# EAGLE design MainBoard_ver2_2 (EAGLE 9.6.2)
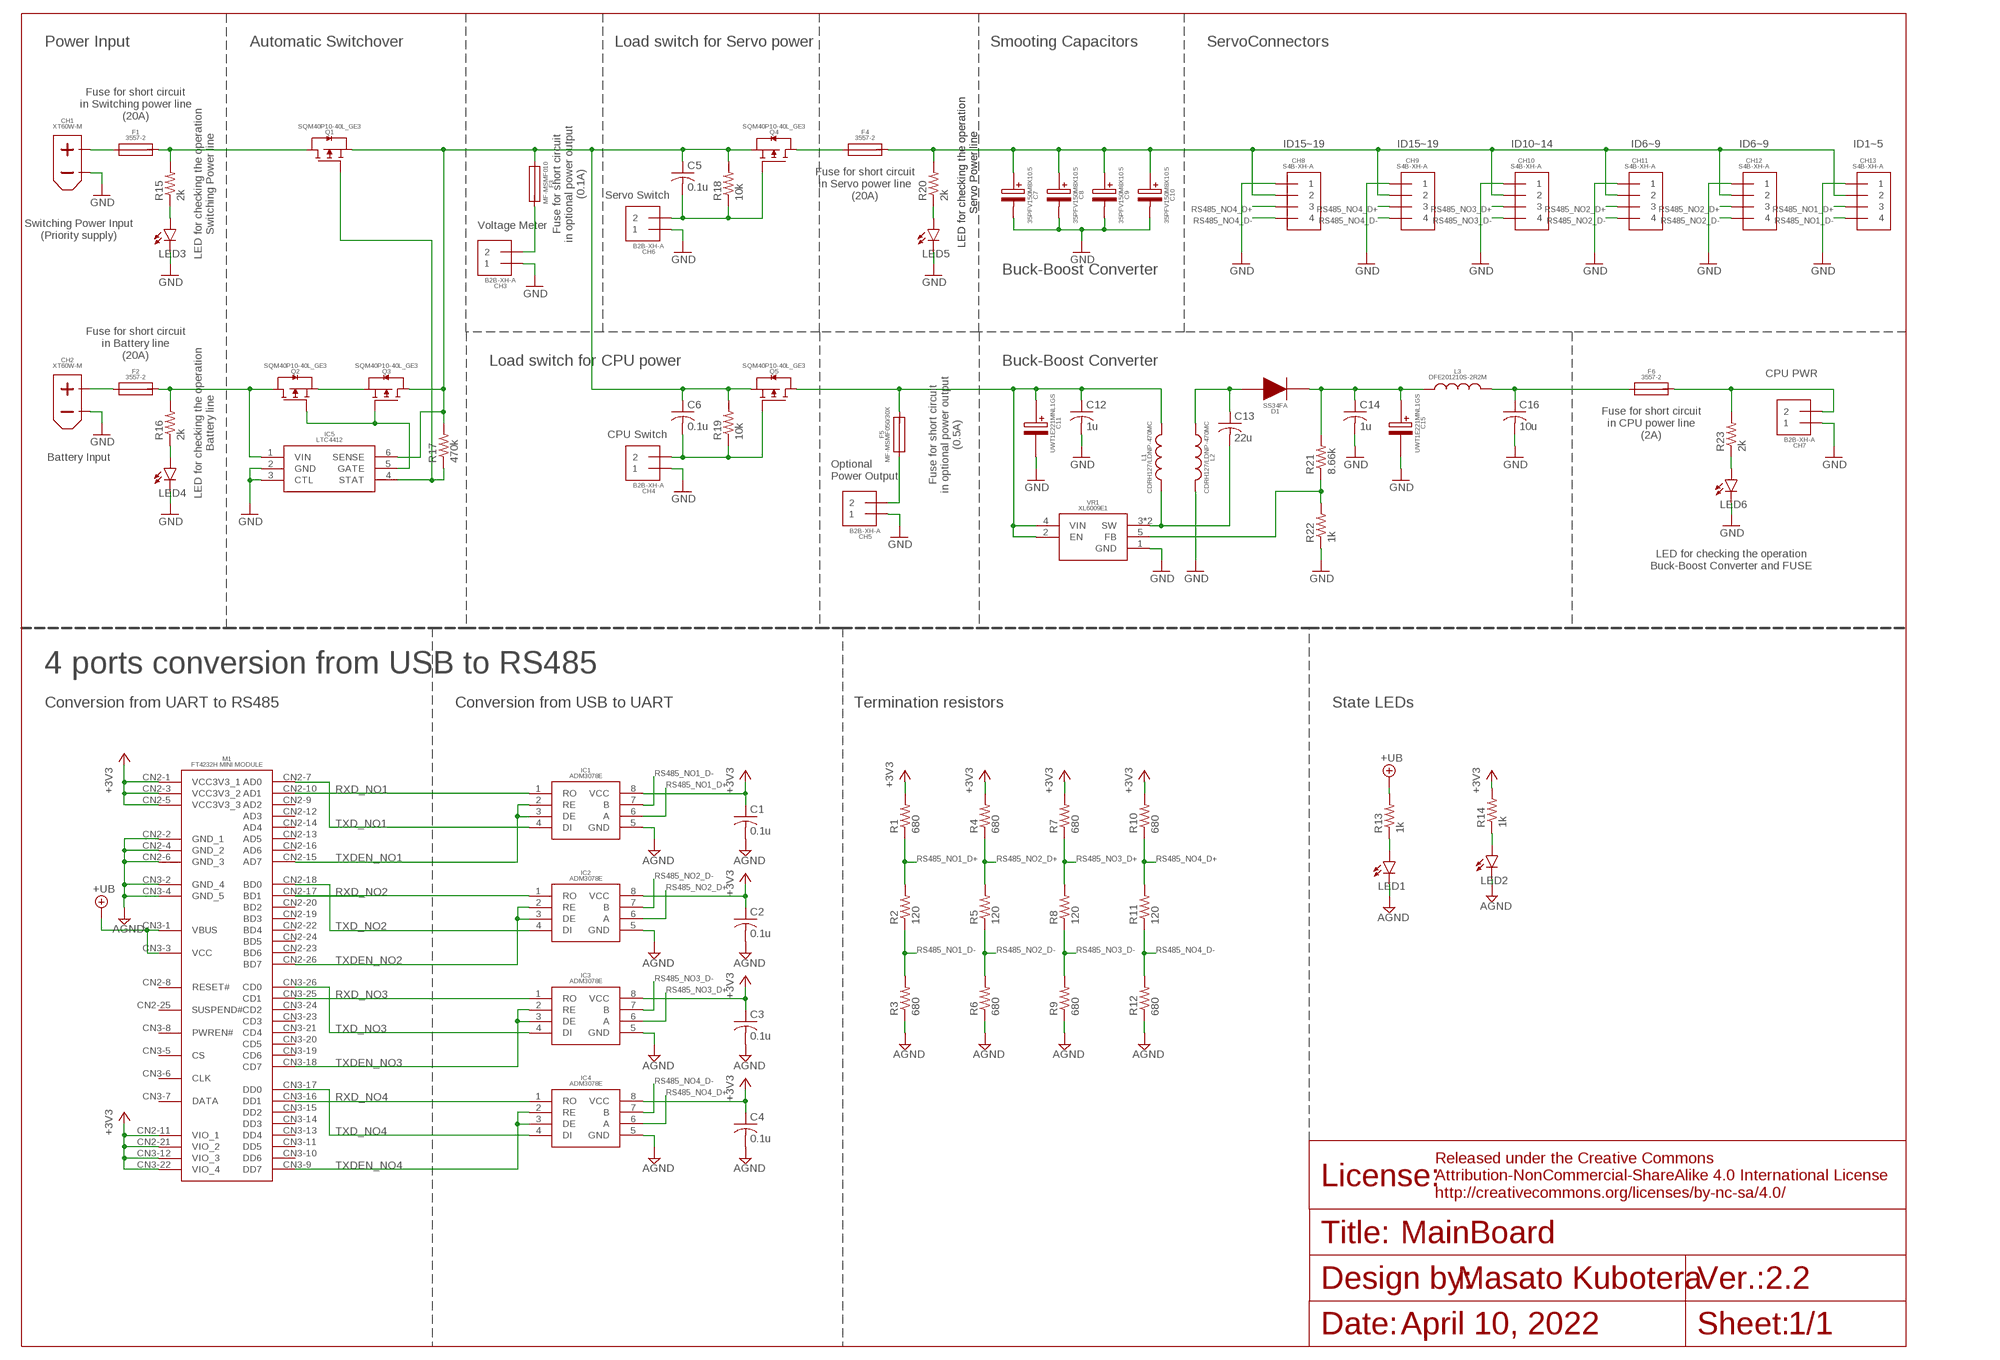
[diagram p0: schematic, sheet 1]

## Parts
C1  0.1u  C-USC0603  [C0603]
C2  0.1u  C-USC0603  [C0603]
C3  0.1u  C-USC0603  [C0603]
C4  0.1u  C-USC0603  [C0603]
C5  0.1u  C-USC0603  [C0603]
C6  0.1u  C-USC0603  [C0603]
C7  35PFV150M8X10.5  [35PFV150M8X10.5]
C8  35PFV150M8X10.5  [35PFV150M8X10.5]
C9  35PFV150M8X10.5  [35PFV150M8X10.5]
C10  35PFV150M8X10.5  [35PFV150M8X10.5]
C11  UWT1E221MNL1GS  [UWT1E221MNL1GS]
C12  1u  C-USC0603  [C0603]
C13  22u  C-USC2012  [C2012]
C14  1u  C-USC0603  [C0603]
C15  UWT1E221MNL1GS  [UWT1E221MNL1GS]
C16  10u  C-USC0603  [C0603]
CH1  XT60PW-M  [XT60PW-M]
CH2  XT60PW-M  [XT60PW-M]
CH3  B2B-XH-A  [B2B-XH-A]
CH4  B2B-XH-A  [B2B-XH-A]
CH5  B2B-XH-A  [B2B-XH-A]
CH6  B2B-XH-A  [B2B-XH-A]
CH7  B2B-XH-A  [B2B-XH-A]
CH8  S4B-XH-A  [S4B-XH-A]
CH9  S4B-XH-A  [S4B-XH-A]
CH10  S4B-XH-A  [S4B-XH-A]
CH11  S4B-XH-A  [S4B-XH-A]
CH12  S4B-XH-A  [S4B-XH-A]
CH13  S4B-XH-A  [S4B-XH-A]
D1  SS34FA  [SS34FA]
F1  3557-2  [3557-2]
F2  3557-2  [3557-2]
F3  MF-MSMF010  [MF-MSMF010]
F4  3557-2  [3557-2]
F5  MF-MSMF050/30X  [MF-MSMF050]
F6  3557-2  [3557-2]
IC1  ADM3078E  [ADM3078E]
IC2  ADM3078E  [ADM3078E]
IC3  ADM3078E  [ADM3078E]
IC4  ADM3078E  [ADM3078E]
IC5  LTC4412  [LTC4412]
L1  CDRH127/LDNP-470MC  [CDRH127/LDNP]
L2  CDRH127/LDNP-470MC  [CDRH127/LDNP]
L3  DFE201210S-2R2M  [DFE201210S]
LED1  LEDSML0603  [SML0603]
LED2  LEDSML0603  [SML0603]
LED3  LEDSML0603  [SML0603]
LED4  LEDSML0603  [SML0603]
LED5  LEDSML0603  [SML0603]
LED6  LEDSML0603  [SML0603]
M1  FT4232H_MINI_MODULE  [FT4232H_MINI_MODULE]
Q1  SQM40P10-40L_GE3  [TO-252-3]
Q2  SQM40P10-40L_GE3  [TO-252-3]
Q3  SQM40P10-40L_GE3  [TO-252-3]
Q4  SQM40P10-40L_GE3  [TO-252-3]
Q5  SQM40P10-40L_GE3  [TO-252-3]
R1  680  R-US_R0603  [R0603]
R2  120  R-US_R0603  [R0603]
R3  680  R-US_R0603  [R0603]
R4  680  R-US_R0603  [R0603]
R5  120  R-US_R0603  [R0603]
R6  680  R-US_R0603  [R0603]
R7  680  R-US_R0603  [R0603]
R8  120  R-US_R0603  [R0603]
R9  680  R-US_R0603  [R0603]
R10  680  R-US_R0603  [R0603]
R11  120  R-US_R0603  [R0603]
R12  680  R-US_R0603  [R0603]
R13  1k  R-US_R0603  [R0603]
R14  1k  R-US_R0603  [R0603]
R15  2k  R-US_R0603  [R0603]
R16  2k  R-US_R0603  [R0603]
R17  470k  R-US_R0603  [R0603]
R18  10k  R-US_R0603  [R0603]
R19  10k  R-US_R0603  [R0603]
R20  2k  R-US_R0603  [R0603]
R21  8.66k  R-US_R0603  [R0603]
R22  1k  R-US_R0603  [R0603]
R23  2k  R-US_R0603  [R0603]
VR1  XL6009E1  [TO263-5L]

## Nets
+3V3 [USB-Power]: C1.1 C2.1 C3.1 C4.1 IC1.8(VCC) IC2.8(VCC) IC3.8(VCC) IC4.8(VCC) M1.CN2-1(VCC3V3_1) M1.CN2-3(VCC3V3_2) M1.CN2-5(VCC3V3_3) M1.CN2-11(VIO_1) M1.CN2-21(VIO_2) M1.CN3-12(VIO_3) M1.CN3-22(VIO_4) R1.2 R4.2 R7.2 R10.2 R14.2
+UB [USB-Power]: M1.CN3-1(VBUS) M1.CN3-3(VCC) R13.2
A_DIODE_DCDC [DCDC-Power]: C14.1 C15.+ D1.1 L3.1 R21.2
A_FUSE_BATT [Battery-Power]: F2.3 F2.4 IC5.1(VIN) Q2.4(D) R16.2
A_FUSE_DCDC [DCDC-Power]: CH7.2 F6.3 F6.4 R23.2
A_FUSE_METER [Meter]: CH3.2 F3.2
A_FUSE_PWR [Battery-Power]: F1.3 F1.4 Q1.4(D) R15.2
A_FUSE_SERVO [Battery-Power]: C7.+ C8.+ C9.+ C10.+ CH8.2 CH9.2 CH10.2 CH11.2 CH12.2 CH13.2 F4.3 F4.4 R20.2
AGND [USB-Power]: C1.2 C2.2 C3.2 C4.2 IC1.5(GND) IC2.5(GND) IC3.5(GND) IC4.5(GND) LED1.C LED2.C M1.CN2-2(GND_1) M1.CN2-4(GND_2) M1.CN2-6(GND_3) M1.CN3-2(GND_4) M1.CN3-4(GND_5) R3.1 R6.1 R9.1 R12.1
B_DIODE_DCDC [DCDC-Power]: C13.1 D1.2 L2.1
B_FUSE_BATT [FUSE-Power]: CH2.+ F2.1 F2.2
B_FUSE_DCDC [DCDC-Power]: C16.1 F6.1 F6.2 L3.2
B_FUSE_PWR [FUSE-Power]: CH1.+ F1.1 F1.2
B_FUSE_SERVO [Battery-Power]: F4.1 F4.2 Q4.4(D)
B_LOAD_CPU [Power_Switching]: C6.2 CH4.2 Q5.1(G) R19.1
B_LOAD_SERVO [Power_Switching]: C5.2 CH6.2 Q4.1(G) R18.1
CPU_PWR_IN [CPU-Power]: C11.+ C12.1 F5.2 L1.2 Q5.4(D) VR1.2(EN) VR1.4(VIN)
FB_DCDC [DCDC-Power]: R21.1 R22.2 VR1.5(FB)
GND [Battery-Power]: C7.- C8.- C9.- C10.- C11.- C12.2 C14.2 C15.- C16.2 CH1.- CH2.- CH3.1 CH4.1 CH5.1 CH6.1 CH7.1 CH8.1 CH9.1 CH10.1 CH11.1 CH12.1 CH13.1 IC5.2(GND) IC5.3(CTL) L2.2 LED3.C LED4.C LED5.C LED6.C R22.1 VR1.1(GND)
INPUT_PWR [Battery-Power]: C5.1 C6.1 F3.1 IC5.6(SENSE) Q1.3(S) Q3.4(D) Q4.3(S) Q5.3(S) R17.2 R18.2 R19.2
LED_3V3 [LED]: LED2.A R14.1
LED_BATT [LED]: LED4.A R16.1
LED_DCDCOUT [LED]: LED6.A R23.1
LED_PWR [LED]: LED3.A R15.1
LED_SERVO [LED]: LED5.A R20.1
LED_UB [LED]: LED1.A R13.1
LTC4412_GATE [Power_Switching]: IC5.5(GATE) Q2.1(G) Q3.1(G)
LTC4412_STAT [Power_Switching]: IC5.4(STAT) Q1.1(G) R17.1
POWER_OUTPUT [PowerOutput]: CH5.2 F5.1
RS485_NO1_D+ [USB-Data]: CH13.3 IC1.6(A) R1.1 R2.2
RS485_NO1_D- [USB-Data]: CH13.4 IC1.7(B) R2.1 R3.2
RS485_NO2_D+ [USB-Data]: CH11.3 CH12.3 IC2.6(A) R4.1 R5.2
RS485_NO2_D- [USB-Data]: CH11.4 CH12.4 IC2.7(B) R5.1 R6.2
RS485_NO3_D+ [USB-Data]: CH10.3 IC3.6(A) R7.1 R8.2
RS485_NO3_D- [USB-Data]: CH10.4 IC3.7(B) R8.1 R9.2
RS485_NO4_D+ [USB-Data]: CH8.3 CH9.3 IC4.6(A) R10.1 R11.2
RS485_NO4_D- [USB-Data]: CH8.4 CH9.4 IC4.7(B) R11.1 R12.2
RXD_NO1 [USB-Data]: IC1.1(RO) M1.CN2-10(AD1)
RXD_NO2 [USB-Data]: IC2.1(RO) M1.CN2-17(BD1)
RXD_NO3 [USB-Data]: IC3.1(RO) M1.CN3-25(CD1)
RXD_NO4 [USB-Data]: IC4.1(RO) M1.CN3-16(DD1)
SOURCE [Battery-Power]: Q2.3(S) Q3.3(S)
SW_DCDC [DCDC-Power]: C13.2 L1.1 VR1.3(SW) VR1.6(SW)
TXD_NO1 [USB-Data]: IC1.4(DI) M1.CN2-7(AD0)
TXD_NO2 [USB-Data]: IC2.4(DI) M1.CN2-18(BD0)
TXD_NO3 [USB-Data]: IC3.4(DI) M1.CN3-26(CD0)
TXD_NO4 [USB-Data]: IC4.4(DI) M1.CN3-17(DD0)
TXDEN_NO1 [USB-Data]: IC1.2(RE) IC1.3(DE) M1.CN2-15(AD7)
TXDEN_NO2 [USB-Data]: IC2.2(RE) IC2.3(DE) M1.CN2-26(BD7)
TXDEN_NO3 [USB-Data]: IC3.2(RE) IC3.3(DE) M1.CN3-18(CD7)
TXDEN_NO4 [USB-Data]: IC4.2(RE) IC4.3(DE) M1.CN3-9(DD7)
Unconnected: M1.CN2-8(RESET#) M1.CN2-9(AD2) M1.CN2-12(AD3) M1.CN2-13(AD5) M1.CN2-14(AD4) M1.CN2-16(AD6) M1.CN2-19(BD3) M1.CN2-20(BD2) M1.CN2-22(BD4) M1.CN2-23(BD6) M1.CN2-24(BD5) M1.CN2-25(SUSPEND#) M1.CN3-5(CS) M1.CN3-6(CLK) M1.CN3-7(DATA) M1.CN3-8(PWREN#) M1.CN3-10(DD6) M1.CN3-11(DD5) M1.CN3-13(DD4) M1.CN3-14(DD3) M1.CN3-15(DD2) M1.CN3-19(CD6) M1.CN3-20(CD5) M1.CN3-21(CD4) M1.CN3-23(CD3) M1.CN3-24(CD2)

## Notes on the sheet
- Power Input | Automatic Switchover | Load switch for Servo power | Smooting Capacitors | ServoConnectors
- Fuse for short circuit
  in Switching power line
  (20A)
- ID15~19 | ID15~19 | ID10~14 | ID6~9 | ID6~9 | ID1~5
- LED for checking the operation
  Servo Power line
- LED for checking the operation
  Servo Power line
- LED for checking the operation
  Switching Power line
- Fuse for short circuit
  in optional power output
  (0.1A)
- Fuse for short circuit
  in Servo power line
  (20A)
- Servo Switch
- Switching Power Input
  (Priority supply)
- Voltage Meter
- Buck-Boost Converter
- Fuse for short circuit
  in Battery line
  (20A)
- Load switch for CPU power | Buck-Boost Converter
- CPU PWR
- LED for checking the operation
  Battery line
- Fuse for short circuit
  in CPU power line
  (2A)
- CPU Switch
- Fuse for short circuit
  in optional power output
  (0.5A)
- Battery Input
- Optional
  Power Output
- LED for checking the operation
  Buck-Boost Converter and FUSE
- 4 ports conversion from USB to RS485
- Conversion from UART to RS485 | Conversion from USB to UART | Termination resistors | State LEDs
- MainBoard
- 2.2
- April 10, 2022 | 1/1

## Library data of the parts
C1-C6 C12-C14 C16 = rcl:C-US: CAPACITOR, American symbol; SPICEPREFIX: C
C7-C10 = 35PFV150M8X10.5:35PFV150M8X10.5
C11 C15 = UWT1E221MNL1GS:UWT1E221MNL1GS
CH1 CH2 = AMASS_XT60:XT60PW-M
CH3-CH7 = JST-XH:B2B-XH-A
CH8-CH13 = JST-XH:S4B-XH-A
D1 = SS34FA:SS34FA
F1 F2 F4 F6 = 3557-2:3557-2
F3 = MF-MSMF:MF-MSMF010
F5 = MF-MSMF:MF-MSMF050/30X
IC1-IC4 = ADM3078E:ADM3078E
IC5 = LTC4412:LTC4412
L1 L2 = CDRH127_LDNP:CDRH127/LDNP-470MC
L3 = DFE201210S:DFE201210S-2R2M
LED1-LED6 = led:LED: LED OSRAM: - CHIPLED LG R971, LG N971, LY N971, LG Q971, LY Q971, LO R971, LY R971 LH N974, LH R974 LS Q976, LO Q976, LY Q976 LO Q996 - Hyper CHIPLED LW Q18S LB Q993, LB Q99A, LB R99A - SideLED LS A670, LO A670, LY A670, LG A670, LP A670 LB A673, LV A673, LT A673, LW A673 LH A674 LY A675 LS A676, LA A676, LO A676, LY A676, LW A676 LS A679, LY A679, LG A679 - Hyper Micro SIDELED® LS Y876, LA Y876, LO Y876, LY Y876 LT Y87S - SmartLED LW L88C, LW L88S LB L89C, LB L89S, LG L890 LS L89K, LO L89K, LY L89K LS L896, LA L896, LO L896, LY L896 - TOPLED LS T670, LO T670, LY T670, LG T670, LP T670 LSG T670, LSP T670, LSY T670, LOP T670, LYG T670 LG T671, LOG T671, LSG T671 LB T673, LV T673, LT T673, LW T673 LH T674 LS T676, LA T676, LO T676, LY T676, LB T676, LH T676, LSB T676, LW T676 LB T67C, LV T67C, LT T67C, LS T67K, LO T67K, LY T67K, LW E67C LS E67B, LA E67B, LO E67B, LY E67B, LB E67C, LV E67C, LT E67C LW T67C LS T679, LY T679, LG T679 LS T770, LO T770, LY T770, LG T770, LP T770 LB T773, LV T773, LT T773, LW T773 LH T774 LS E675, LA E675, LY E675, LS T675 LS T776, LA T776, LO T776, LY T776, LB T776 LHGB T686 LT T68C, LB T68C - Hyper Mini TOPLED® LB M676 - Mini TOPLED Santana® LG M470 LS M47K, LO M47K, LY M47K Source: http://www.osram.convergy.de LUXEON: - LUMILED® LXK2-PW12-R00, LXK2-PW12-S00, LXK2-PW14-U00, LXK2-PW14-V00 LXK2-PM12-R00, LXK2-PM12-S00, LXK2-PM14-U00 LXK2-PE12-Q00, LXK2-PE12-R00, LXK2-PE12-S00, LXK2-PE14-T00, LXK2-PE14-U00 LXK2-PB12-K00, LXK2-PB12-L00, LXK2-PB12-M00, LXK2-PB14-N00, LXK2-PB14-P00, LXK2-PB14-Q00 LXK2-PR12-L00, LXK2-PR12-M00, LXK2-PR14-Q00, LXK2-PR14-R00 LXK2-PD12-Q00, LXK2-PD12-R00, LXK2-PD12-S00 LXK2-PH12-R00, LXK2-PH12-S00 LXK2-PL12-P00, LXK2-PL12-Q00, LXK2-PL12-R00 Source: www.luxeon.com KINGBRIGHT: KA-3528ASYC Source: www.kingbright.com
M1 = FT4232H_MINI_MODULE:FT4232H_MINI_MODULE
Q1-Q5 = Vishay_FET:SQM40P10-40L_GE3
R1-R23 = rcl:R-US_: RESISTOR, American symbol; SPICEPREFIX: R
VR1 = XL6009E1:XL6009E1

## Net classes
0 default: width 0.254 mm, drill 0.127 mm, clearance 0.203 mm
1 USB-Data: width 0.203 mm, drill 0.127 mm, clearance 0.203 mm
2 USB-Power: width 0.254 mm, drill 0.127 mm, clearance 0.203 mm
3 CPU-Power: width 2.54 mm, drill 1.27 mm, clearance 0.203 mm
4 Battery-Power: width 2.54 mm, drill 1.27 mm, clearance 0.203 mm
5 FUSE-Power: width 3.048 mm, drill 1.27 mm, clearance 0.203 mm
6 DCDC-Power: width 1.143 mm, drill 0.254 mm, clearance 0.203 mm
7 Power_Switching: width 0.508 mm, drill 0.254 mm, clearance 0.203 mm
8 LED: width 0.254 mm, drill 0.127 mm, clearance 0.203 mm
9 Meter: width 0.508 mm, drill 0.254 mm, clearance 0.203 mm
10 PowerOutput: width 1.143 mm, drill 0.254 mm, clearance 0.203 mm

## Board
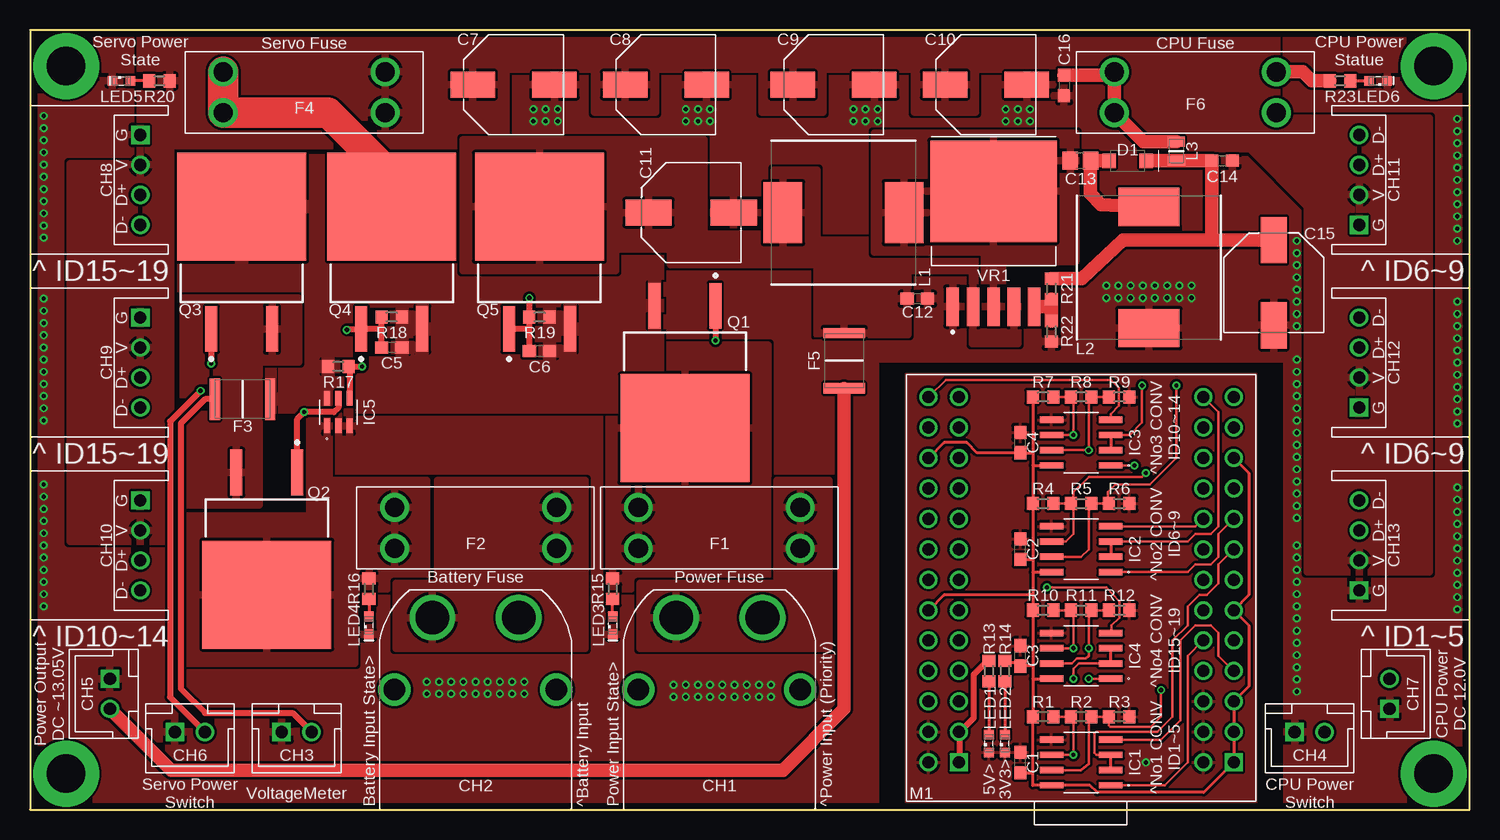
[diagram p1: board, top side]
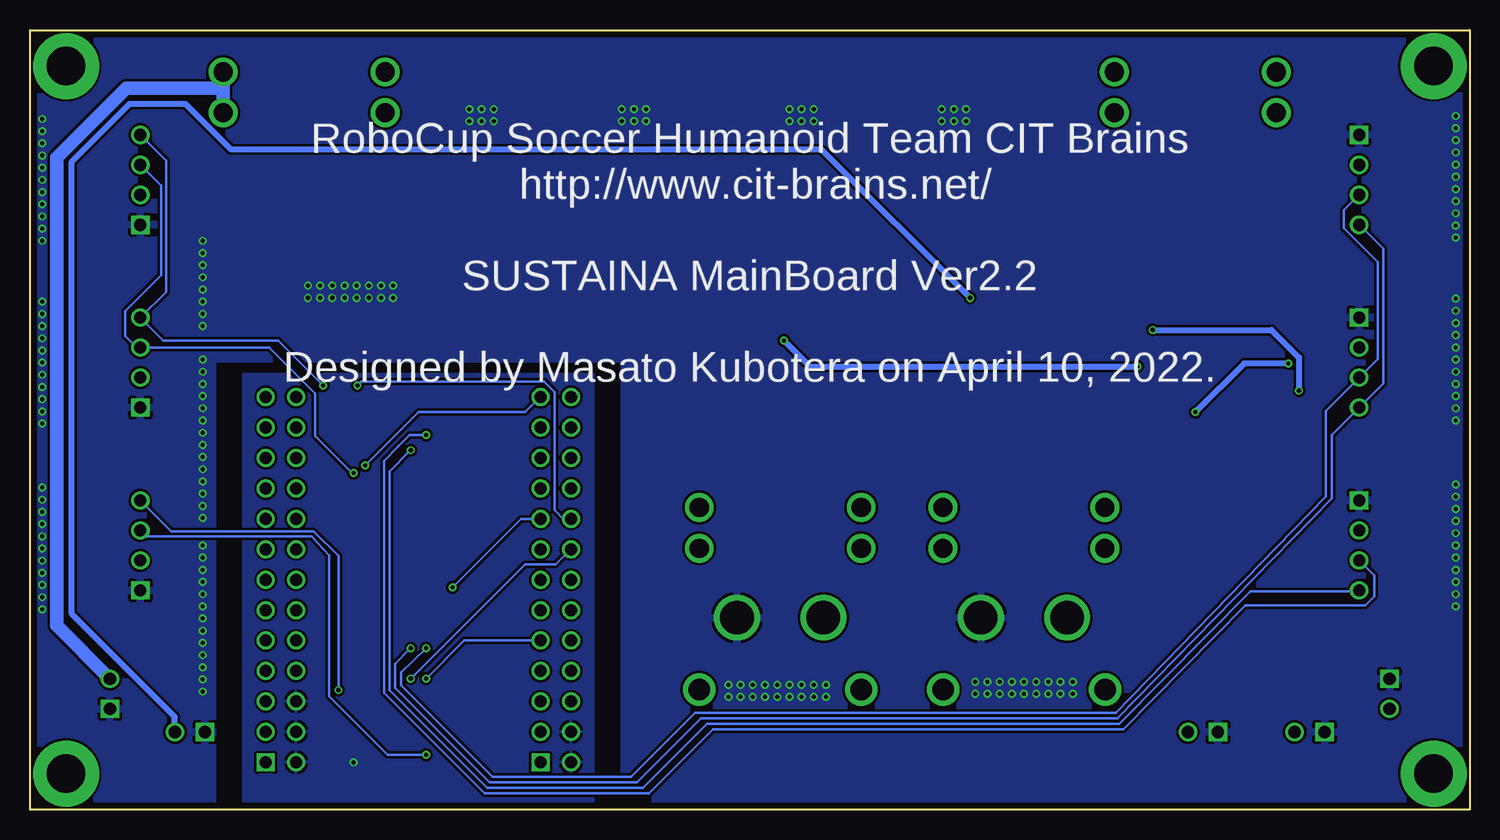
[diagram p2: board, bottom side, seen from below]

Size 120 x 65 mm. Coordinates in mm from the lower left corner, seen from the top.
Outline: 0,65 0,0 120,0 120,65 0,65
Copper layers (1*16): Top 0.035mm / dielectric 1.6mm / Bottom 0.035mm
Design rules "Elecrow_2-layer_PCB_eagle_rule *": minimum track width 6mil, minimum drill 12mil, track to track 6mil, track to pad 6mil, pad to pad 6mil, via to via 8mil, smd to smd 0mil, copper to edge 20mil, drill to drill 10mil, minimum pad ring 6mil, minimum via ring 6mil, stop-mask expansion 0mil, vias tented up to drill 100mil, thermal gap 10mil

### Footprints (pad centres in the part's own frame; a part is rotated, then mirrored left to right if it is on the bottom)
C0603 = smd 1.1 x 1: 1 -0.85,0; 2 0.85,0
35PFV150M8X10.5 = smd 3.7 x 2.15: + -3.4,0; - 3.4,0
UWT1E221MNL1GS = smd 3.85 x 2.15: + -3.55,0; - 3.55,0
C2012 = smd 1.3 x 1.5: 1 -0.85,0; 2 0.85,0
XT60PW-M = drill 1.8: 1 -6.75,-10; 2 6.75,-10 | drill 2.8: + 3.6,-16; - -3.6,-16
B2B-XH-A = drill 1.016 square: 1 -1.25,0 | drill 1.016: 2 1.25,0
S4B-XH-A = drill 1.016 square: 1 3.75,0 | drill 1.016: 2 1.25,0; 3 -1.25,0; 4 -3.75,0
SS34FA = smd 1.12 x 1.22: 1 -1.55,0; 2 1.55,0
3557-2 = drill 1.6: 1 -6.75,1.7; 2 -6.75,-1.7; 3 6.75,1.7; 4 6.75,-1.7
MF-MSMF010 = smd 0.85 x 3.43: 1 -2.3,0; 2 2.3,0
MF-MSMF050 = smd 0.85 x 3.43: 1 -2.3,0; 2 2.3,0
ADM3078E = smd 1.981 x 0.533: 1 -2.464,1.905; 2 -2.464,0.635; 3 -2.464,-0.635; 4 -2.464,-1.905; 5 2.464,-1.905; 6 2.464,-0.635; 7 2.464,0.635; 8 2.464,1.905
LTC4412 = smd 1.219 x 0.508: 1 -1.143,0.95; 2 -1.143,0; 3 -1.143,-0.95; 4 1.143,-0.95; 5 1.143,0; 6 1.143,0.95
CDRH127/LDNP = smd 3.2 x 5.1: 1 -5.05,0; 2 5.05,0
DFE201210S = smd 0.8 x 1.4: 1 -0.8,0; 2 0.8,0
SML0603 = smd 0.8 x 0.8: A 0.75,0; C -0.75,0
FT4232H_MINI_MODULE = drill 1 square: CN2-1 -12.715,16.51; CN3-1 10.175,16.51 | drill 1: CN2-2 -10.175,16.51; CN2-3 -12.715,13.97; CN2-4 -10.175,13.97; CN2-5 -12.715,11.43; CN2-6 -10.175,11.43; CN2-7 -12.715,8.89; CN2-8 -10.175,8.89; CN2-9 -12.715,6.35; CN2-10 -10.175,6.35; CN2-11 -12.715,3.81; CN2-12 -10.175,3.81; CN2-13 -12.715,1.27; CN2-14 -10.175,1.27; CN2-15 -12.715,-1.27; CN2-16 -10.175,-1.27; CN2-17 -12.715,-3.81; CN2-18 -10.175,-3.81; CN2-19 -12.715,-6.35; CN2-20 -10.175,-6.35; CN2-21 -12.715,-8.89; CN2-22 -10.175,-8.89; CN2-23 -12.715,-11.43; CN2-24 -10.175,-11.43; CN2-25 -12.715,-13.97; CN2-26 -10.175,-13.97; CN3-2 12.715,16.5; CN3-3 10.175,13.97; CN3-4 12.715,13.97; CN3-5 10.175,11.43; CN3-6 12.715,11.43; CN3-7 10.175,8.89; CN3-8 12.715,8.89; CN3-9 10.175,6.35; CN3-10 12.715,6.35; CN3-11 10.175,3.81; CN3-12 12.715,3.81; CN3-13 10.175,1.27; CN3-14 12.715,1.27; CN3-15 10.175,-1.27; CN3-16 12.715,-1.27; CN3-17 10.175,-3.81; CN3-18 12.715,-3.81; CN3-19 10.175,-6.35; CN3-20 12.715,-6.35; CN3-21 10.175,-8.89; CN3-22 12.715,-8.89; CN3-23 10.175,-11.43; CN3-24 12.715,-11.43; CN3-25 10.175,-13.97; CN3-26 12.715,-13.97
TO-252-3 = smd 3.8 x 1: 1 -6.4,2.54; 3 -6.4,-2.54 | smd 9 x 10.75: 4 3.8,0
R0603 = smd 1 x 1.1: 1 -0.85,0; 2 0.85,0
TO263-5L = smd 3.21 x 1.05: 1 -6.13,3.4; 2 -6.13,1.7; 3 -6.13,0; 4 -6.13,-1.7; 5 -6.13,-3.4 | smd 8.46 x 10.53: 6 3.5,0

### Placement (x,y rotation side)
C1  82.54,3.93 90 top
C2  82.54,21.7 90 top
C3  82.54,12.82 90 top
C4  82.54,30.59 90 top
C5  30.16,38.53 180 top
C6  42.47,38.22 180 top
C7  40.31,60.44 0 top
C8  53.02,60.44 0 top
C9  66.98,60.44 0 top
C10  79.69,60.44 0 top
C11  55.11,49.77 0 top
C12  73.97,42.6 0 top
C13  87.56,54.09 180 top
C14  99.37,54.09 0 top
C15  103.69,43.93 270 top
C16  86.19,60.38 270 top
CH1  57.46,0 180 top
CH2  37.14,0 180 top
CH3  22.22,6.46 0 top
CH4  106.67,6.46 0 top
CH5  6.66,9.64 270 top
CH6  13.33,6.46 0 top
CH7  113.34,9.64 90 top
CH8  9.2,52.5 90 top
CH9  9.2,37.26 90 top
CH10  9.2,22.02 90 top
CH11  110.8,52.5 270 top
CH12  110.8,37.26 270 top
CH13  110.8,22.02 270 top
D1  91.5,54.09 180 top
F1  57.46,23.48 180 top
F2  37.14,23.48 180 top
F3  17.71,34.21 180 top
F4  22.85,59.8 0 top
F5  67.87,37.42 90 top
F6  97.15,59.8 0 top
IC1  87.62,3.93 180 top
IC2  87.62,21.7 180 top
IC3  87.62,30.59 180 top
IC4  87.62,12.82 180 top
IC5  25.71,33.13 90 top
L1  67.81,49.77 180 top
L2  93.27,45.2 270 top
L3  95.56,54.89 90 top
LED1  79.94,5.51 90 top
LED2  81.27,5.51 90 top
LED3  48.57,15.36 90 top
LED4  28.25,15.36 90 top
LED5  7.61,60.76 0 top
LED6  112.39,60.76 180 top
M1  87.62,20.44 180 top
Q1  54.6,35.61 270 top
Q2  19.74,21.7 270 top
Q3  17.65,46.47 90 top
Q4  30.16,46.47 90 top
Q5  42.47,46.47 90 top
R1  84.45,7.73 180 top
R2  87.62,7.73 180 top
R3  90.8,7.73 180 top
R4  84.45,25.52 180 top
R5  87.62,25.52 180 top
R6  90.8,25.52 180 top
R7  84.45,34.41 180 top
R8  87.62,34.41 180 top
R9  90.8,34.41 180 top
R10  84.45,16.62 180 top
R11  87.62,16.62 180 top
R12  90.8,16.62 180 top
R13  79.94,11.55 90 top
R14  81.27,11.55 90 top
R15  48.57,18.4 90 top
R16  28.25,18.4 90 top
R17  25.71,36.95 180 top
R18  30.16,41.07 0 top
R19  42.47,41.07 0 top
R20  10.79,60.76 0 top
R21  85.15,43.42 90 top
R22  85.15,39.87 90 top
R23  109.21,60.76 180 top
VR1  80.32,48.06 90 top

### Tracks (layer width: path | path; a pad name or v marks a point on that pad's centre or on a via)
+3V3
  Top 0.254: 83.6,28.69 IC3.8 | 83.6,19.8 IC2.8 | 83.6,10.91 IC4.8 | 83.6,29.75 C4.1 78.95,29.75 78.1,30.59 76.19,30.59 74.92,29.32 M1.CN3-22 | 83.6,11.96 C3.1 | R7.2 83.6,29.75 | 83.6,29.75 83.6,28.69 | 83.6,28.69 R4.2 83.6,20.86 | C2.1 83.6,20.86 | 83.6,20.86 83.6,19.8 | 83.6,19.8 83.6,17.89 | 83.6,17.89 R10.2 83.6,11.96 | 83.6,11.96 83.6,10.91 | 83.6,10.91 R1.2 83.6,3.07 | C1.1 83.6,3.07 | 83.6,3.07 83.6,2.02 IC1.8 88.36,2.02 88.96,1.42 97.84,1.42 M1.CN2-1 M1.CN2-3 M1.CN2-5 101.59,10.26 101.59,15.36 M1.CN2-11 101.59,17.89 101.59,28.05 M1.CN2-21 | M1.CN3-12 74.92,16.62 76.19,17.89 83.6,17.89 | C3.1 82.54,12.09 | C3.1 82.29,12.22 81.45,12.22 R14.2
+UB
  Top 0.254: 77.46,3.93 M1.CN3-1 | M1.CN3-3 77.46,6.46
  Top 0.508: 77.46,6.46 77.46,6.42 | 77.46,6.42 77.46,3.93 | R13.2 79.81,12.39 78.66,11.24 78.66,7.62 77.46,6.42
A_DIODE_DCDC
  Top 1.143: R21.2 87.69,44.27 91.08,47.48 98.52,47.48 | 98.52,47.48 C15.+ | 93.05,54.07 D1.1 L3.1 C14.1 | C14.1 98.26,54.09 | C14.1 98.52,47.48
A_FUSE_BATT
  Top 2.54: Q2.4 21.33,17.91
  pour Top (rank 5): 11.99,24.5 11.99,12.18 27.04,12.18 27.04,18.4 29.77,18.4 29.77,19.55 33.08,19.55 33.08,27.42 24.95,27.42 24.95,33.01 23.3,33.01 23.3,24.5
A_FUSE_DCDC
  Top 1.143: R23.2 106.87,60.76 106.12,61.5 F6.3
  Bottom 1.143: F6.3 F6.4 103.9,60.14 111.99,60.14 117.78,54.34 117.78,15.34 CH7.2
A_FUSE_METER
  Top 0.508: F3.2 14.58,34.21 12.58,32.21 12.58,10.07 14.6,8.05 21.88,8.05 CH3.2
A_FUSE_PWR
  pour Top (rank 4): 48.25,38.72 48.25,18.4 50.09,18.4 50.09,19.55 61.52,19.55 61.52,38.72
A_FUSE_SERVO
  pour Top (rank 4): 3.36,53.84 3.36,22.34 11.74,22.34 11.74,55.36 39.68,55.36 39.68,61.71 47.05,61.71 47.05,58.15 52.13,58.15 52.13,61.71 61.02,61.71 61.02,58.15 66.1,58.15 66.1,61.71 73.72,61.71 73.72,58.15 78.8,58.15 78.8,61.71 90.48,61.71 90.48,57.8 93.86,55.09 101.67,55.09 106.48,50.28 106.48,19.8 116.64,19.8 116.64,57.65 103.94,57.65 103.94,65.52 9.2,65.52 9.2,53.84
AGND  (via drill 0.35)
  Top 0.254: IC2.5 85.08,23.61 IC2.5 | IC3.5 85.08,32.5 IC3.5
  other vias: 93.02,3.93
  pour Top: 73.02,-3.06 73.02,36.31 102.23,36.31 102.23,-3.06
  pour Bottom: 73.02,-1.79 73.02,36.31 102.23,36.31 102.23,-1.79
B_DIODE_DCDC
  Top 1.143: 92.77,51.08 L2.1 | D1.2 C13.1 88.41,51.34 89.29,50.45 L2.1 | L2.1 93.25,50.59
B_FUSE_BATT
  pour Top: 30.54,18.85 30.54,13.45 46.28,13.45 46.28,27.42 33.97,27.42 33.97,18.85
B_FUSE_DCDC
  Top 1.143: C16.1 90.12,61.23 F6.1 F6.2 92.81,55.69 L3.2
B_FUSE_PWR
  pour Top: 50.86,18.85 50.86,13.45 66.6,13.45 66.6,27.42 62.29,27.42 62.29,18.85
B_FUSE_SERVO
  Top 2.54: F4.1 F4.2 24.86,58.11 30.16,52.81 Q4.4 29.12,50.68 30.16,49.64
B_LOAD_CPU  (via drill 0.35)
  Top 0.508: 41.62,40.12 R19.1 v41.62,42.66 | 41.62,40.12 C6.2 | Q5.1 39.98,40.12 41.62,40.12
  Bottom 0.508: CH4.2 107.92,7.71 116.52,16.31 116.52,54.03 111.69,58.85 107.05,58.85 103.25,55.05 54.07,55.05 v41.62,42.66
B_LOAD_SERVO  (via drill 0.35)
  Top 0.508: C5.2 R18.1 29.3,40.12 27.66,40.12 Q4.1 26.49,40.07 v26.41,39.99 | v14.22,34.91 11.68,32.37 11.68,9.37 CH6.2
  Bottom 0.508: v26.41,39.99 16.5,39.99 14.22,37.71 v14.22,34.91
CPU_PWR_IN
  pour Top (rank 2): 36.12,55.87 36.12,44.95 48.82,44.95 48.82,46.72 53.4,46.72 53.4,45.45 65.59,45.45 65.59,39.61 73.21,39.61 73.21,44.95 78.54,44.95 78.54,38.85 82.35,38.85 82.35,43.17 82.1,42.91 79.3,42.91 79.3,47.49 65.59,47.49 65.59,53.33 62.03,53.33 62.03,47.99 56.19,47.99 56.19,55.87
FB_DCDC
  Top 1.143: R22.2 85.15,41.9 | 85.15,41.9 R21.1 | VR1.5 85.12,41.93 85.15,41.9
GND  (via drill 0.35)
  other vias: 33.08,10.66 34.09,10.66 35.11,10.66 36.12,10.66 37.14,10.66 38.16,10.66 39.17,10.66 40.19,10.66 41.2,10.66 53.65,10.4 54.67,10.4 55.68,10.4 56.7,10.4 57.71,10.4 58.73,10.4 58.73,9.39 57.71,9.39 56.7,9.39 55.68,9.39 54.67,9.39 53.65,9.39 41.2,9.64 40.19,9.64 39.17,9.64 38.16,9.64 37.14,9.64 36.12,9.64 35.11,9.64 34.09,9.64 33.08,9.64 59.75,10.4 60.76,10.4 61.78,10.4 61.78,9.39 60.76,9.39 59.75,9.39 41.97,58.41 42.98,58.41 44,58.41 54.67,58.41 55.68,58.41 56.7,58.41 56.7,57.39 55.68,57.39 54.67,57.39 44,57.39 42.98,57.39 41.97,57.39 68.64,58.41 69.65,58.41 70.67,58.41 70.67,57.39 69.65,57.39 68.64,57.39 81.34,58.41 82.35,58.41 83.37,58.41 83.37,57.39 82.35,57.39 81.34,57.39 93.78,43.68 92.77,43.68 91.75,43.68 93.78,42.66 92.77,42.66 91.75,42.66 95.81,43.68 95.81,42.66 96.83,43.68 96.83,42.66 94.8,43.68 94.8,42.66 90.73,43.68 89.72,43.68 90.73,42.66 89.72,42.66 118.99,52.5 118.99,47.42 118.99,48.44 118.99,49.45 118.99,50.47 118.99,51.49 118.99,54.53 118.99,53.52 118.99,37.26 118.99,32.18 118.99,33.2 118.99,34.21 118.99,35.23 118.99,36.25 118.99,39.29 118.99,38.28 118.99,21.77 118.99,16.69 118.99,17.7 118.99,18.72 118.99,19.74 118.99,20.75 118.99,23.8 118.99,22.78 118.99,25.83 118.99,41.33 118.99,40.31 118.99,42.34 118.99,24.82 118.99,26.85 118.99,56.57 118.99,57.58 118.99,55.55 1.14,52.76 1.14,47.68 1.14,48.69 1.14,49.71 1.14,50.72 1.14,51.74 1.14,54.79 1.14,53.77 1.14,37.52 1.14,32.44 1.14,33.45 1.14,34.47 1.14,35.48 1.14,36.5 1.14,39.55 1.14,38.53 1.14,22.02 1.14,16.94 1.14,17.96 1.14,18.97 1.14,19.99 1.14,21.01 1.14,24.05 1.14,23.04 1.14,26.09 1.14,41.58 1.14,40.56 1.14,42.6 1.14,25.07 1.14,27.1 1.14,56.82 1.14,57.84 1.14,55.8 105.59,45.39 105.59,40.31 105.59,41.33 105.59,42.34 105.59,43.36 105.59,44.37 105.59,47.42 105.59,46.41 105.59,35.48 105.59,30.4 105.59,31.42 105.59,32.44 105.59,33.45 105.59,34.47 105.59,37.52 105.59,36.5 105.59,29.39 105.59,28.37 105.59,27.36 105.59,26.34 105.59,25.32 105.59,24.31 105.59,19.99 105.59,14.91 105.59,15.93 105.59,16.94 105.59,17.96 105.59,18.97 105.59,22.02 105.59,21.01 105.59,13.89 105.59,12.88 105.59,11.86 105.59,10.85 105.59,9.83
  pour Top (rank 6): -3.5,68.06 -3.5,-3.06 70.48,-3.06 70.48,37.58 104.77,37.58 104.77,-3.06 123.5,-3.06 123.5,68.06
  pour Bottom (rank 6): -2.23,66.79 -2.23,-1.79 70.48,-1.79 70.48,37.58 104.77,37.58 104.77,-1.79 122.23,-1.79 122.23,66.79
HOLE1  (via drill 3.2 pad 5.5)
  other vias: 3,62
HOLE2  (via drill 3.2 pad 5.5)
  other vias: 3,3
HOLE3  (via drill 3.2 pad 5.5)
  other vias: 117,62
HOLE4  (via drill 3.2 pad 5.5)
  other vias: 117,3
INPUT_PWR
  pour Top (rank 3): 52.32,54.09 12.82,54.09 12.82,33.58 52.32,33.58
LED_3V3
  Top 0.254: R14.1 LED2.A
LED_BATT
  Top 0.254: 28.25,15.93 LED4.A R16.1 28.25,17.2
LED_DCDCOUT
  Top 0.254: R23.1 LED6.A
LED_PWR
  Top 0.254: LED3.A R15.1
LED_SERVO
  Top 0.254: R20.1 LED5.A 8.56,60.76
LED_UB
  Top 0.254: 79.94,6.33 LED1.A R13.1
LTC4412_GATE  (via drill 0.35)
  Top 0.508: 22.53,28.36 Q2.1 22.28,32.56 v22.85,33.13 25.33,33.13 25.71,33.52 IC5.5 | Q3.1 v15.1,37.2
  Bottom 0.508: v15.1,37.2 18.79,37.2 v22.85,33.13
LTC4412_STAT  (via drill 0.35)
  Top 0.508: IC5.4 26.66,36.84 R17.1 v27.68,36.95 | Q1.1 v57.14,39.1
  Bottom 0.508: v57.14,39.1 54.98,36.95 v27.68,36.95
POWER_OUTPUT
  Top 1.143: CH5.2 11.76,3.29 62.77,3.29 67.87,8.39 67.87,35.08 F5.1
RS485_NO1_D+  (via drill 0.35)
  Top 0.203: R1.1 R2.2 86.99,7.52 v86.99,4.56 IC1.6
  Bottom 0.203: v86.99,4.56 90.18,4.56 95.05,9.43 95.05,21.17 96.51,22.77 110.3,22.77 CH13.3
RS485_NO1_D-  (via drill 0.35)
  Top 0.203: IC1.7 87.62,3.29 88.26,3.82 88.26,7.42 R2.1 R3.2 | 89.93,7.79 R3.2 | 89.95,7.42 R3.2 | R3.2 89.95,7 90.07,6.88 93.44,6.88 94.29,7.73 v94.29,9.96
  Bottom 0.203: v94.29,9.96 94.29,21.13 96.34,23.18 108.21,23.18 CH13.4
RS485_NO2_D+  (via drill 0.35)
  Top 0.203: IC2.6 86.35,22.34 86.99,22.98 86.99,25.2 R5.2 | R4.1 R5.2 | R5.2 86.99,25.83 86.99,26.47 88.26,27.74 92.7,27.74 v93.02,28.05
  Bottom 0.203: v93.02,28.05 93.12,28.05 96.22,31.15 96.22,34.69 100.04,38.51 CH12.3 | CH11.3 109.06,52.02 109.06,44.58 112.07,41.57 112.07,39.48 111.1,38.51 CH12.3 | CH12.3 110.8,38.6
RS485_NO2_D-  (via drill 0.35)
  Top 0.203: 88.26,25.2 88.26,21.7 87.62,21.07 IC2.7 | R5.1 R6.2 89.84,25.83 89.84,26.47 90.48,27.1 93.34,27.1 95.56,29.32 v95.56,35.36
  Top 0.254: 88.26,25.2 R5.1
  Bottom 0.203: 95.62,35.36 v95.56,35.36 99.31,39.11 108.9,39.11 CH12.4 | CH12.4 110.8,41.1 | CH11.4 108.66,54.11 108.66,43.16 CH12.4
RS485_NO3_D+  (via drill 0.35)
  Top 0.203: R7.1 R8.2 86.99,34.24 v86.99,31.23 IC3.6
  Bottom 0.203: v86.99,31.23 88.36,31.23 89.26,30.33 90.48,29.05 90.48,9.74 82.1,1.36 68.38,1.36 63.05,6.69 28.86,6.69 18.67,17.01 8.69,17.01 7.93,17.77 7.93,19.5 CH10.3
RS485_NO3_D-  (via drill 0.35)
  Top 0.203: R9.2 R8.1 88.42,34.41 88.26,34.25 v88.26,29.96 IC3.7
  Bottom 0.203: v88.26,29.96 90.02,28.2 90.02,9.95 81.89,1.82 68.89,1.82 63.56,7.15 29.18,7.15 18.29,18.2 9.26,18.2 CH10.4
RS485_NO4_D+  (via drill 0.35)
  Top 0.203: IC4.6 v86.99,13.45 86.99,16.4 | R10.1 R11.2
  Top 0.254: 86.99,16.4 R11.2
  Bottom 0.203: v86.99,13.45 89.06,11.42 89.06,10.35 81.44,2.73 69.91,2.73 64.57,8.07 29.48,8.07 11.99,26.12 11.99,33.22 CH9.3 7.64,37.58 7.64,45.63 10.47,48.46 10.47,49.98 CH8.3
RS485_NO4_D-  (via drill 0.35)
  Top 0.203: R11.1 R12.2 | 88.26,16.41 v88.26,13.45 88.26,12.82 88.03,12.59 87.27,12.59 86.86,12.18 IC4.7
  Top 0.254: R11.1 88.26,16.41
  Bottom 0.203: v88.26,13.45 88.35,13.41 89.57,12.13 89.57,10.15 81.69,2.27 69.4,2.27 64.06,7.61 29.34,7.61 11.49,25.93 11.49,31.23 CH9.4 7.19,35.51 7.19,46.79 9.14,48.73 CH8.4
RXD_NO1
  Top 0.203: IC1.1 94.61,2.02 96.51,3.93 96.51,12.82 97.78,14.09 M1.CN2-10
RXD_NO2
  Top 0.203: IC2.1 96.51,19.8 97.15,20.44 98.42,20.44 99.05,21.07 99.05,22.98 100.32,24.24 M1.CN2-17
RXD_NO3  (via drill 0.35)
  Top 0.203: v92.07,28.69 IC3.1
  Bottom 0.203: v92.07,28.69 87.62,33.13 78.72,33.13 M1.CN3-25
RXD_NO4  (via drill 0.35)
  Top 0.203: v88.26,10.91 IC4.1
  Bottom 0.203: v88.26,10.91 87.93,11.23 78.72,20.44 76.18,20.44 M1.CN3-16
SOURCE
  pour Top: 12.76,42.66 22.41,42.66 22.41,37.33 19.11,37.33 19.11,25.39 12.76,25.39
SW_DCDC
  pour Top: 70.41,56.38 70.41,46.47 79.56,46.47 79.56,41.39 81.08,41.39 81.08,45.71 87.18,45.71 87.18,56.38
TXD_NO1
  Top 0.203: IC1.4 94.29,5.83 95.88,7.42 95.88,14.09 97.15,15.36 98.42,15.36 99.05,14.72 99.05,12.82 100.32,11.55 M1.CN2-7
TXD_NO2
  Top 0.203: IC2.4 97.15,23.61 97.78,24.24 M1.CN2-18
TXD_NO3
  Top 0.203: IC3.4 90.09,32.98 90.77,33.67 90.77,35.15 90.11,35.81 76.34,35.81 75,34.47 M1.CN3-26
TXD_NO4  (via drill 0.35)
  Top 0.203: v84.77,18.53 89.72,18.53 90.8,17.35 90.8,15.99 90.16,15.36 90.16,14.72 IC4.4
  Bottom 0.203: v84.77,18.53 79.05,24.24 M1.CN3-17
TXDEN_NO1
  Top 0.203: IC1.3 88.89,4.56 88.73,4.72 88.73,6.31 88.89,6.46 93.97,6.46 95.24,7.73 95.24,14.09 96.51,15.36 96.51,16.94 97.47,17.89 98.1,17.89 99.05,18.85 99.05,20.44 100.32,21.7 M1.CN2-15
  Top 0.254: IC1.2 IC1.3
TXDEN_NO2
  Top 0.203: IC2.3 96.51,22.34 97.15,22.98 98.42,22.98 99.05,23.61 99.05,33.13 97.8,34.39 M1.CN2-26
  Top 0.254: IC2.3 IC2.2
TXDEN_NO3  (via drill 0.35)
  Top 0.203: v92.7,35.36 92.7,32.26 91.67,31.23 IC3.3
  Top 0.254: IC3.3 IC3.2
  Bottom 0.203: v92.7,35.36 92.38,35.67 77.14,35.67 76.28,34.81 76.28,24.99 75.54,24.24 M1.CN3-18
TXDEN_NO4  (via drill 0.35)
  Top 0.203: IC4.2 87.44,12.18 86.97,11.72 86.97,10.91 v86.99,10.91
  Top 0.254: IC4.2 IC4.3
  Bottom 0.203: 86.97,10.95 v86.99,10.91 83.81,14.09 M1.CN3-9

### Text on the board
tPlace: Servo Power / State | Servo Fuse | CPU Fuse | CPU Power / Statue | G | D- | V | D+ | D+ | V | D- | G | ^ ID15~19 | ^ ID6~9 | G | D- | V | D+ | D+ | V | D- | G | ^No3 CONV / ID10~14 | ^ ID15~19 | ^ ID6~9 | G | D- | V | D+ | ^No2 CONV / ID6~9 | D+ | V | Battery Fuse | Power Fuse | D- | G | ^ ID10~14 | ^No4 CONV / ID15~19 | ^ ID1~5 | Power Output / DC ~13.05V | CPU Power / DC 12.0V | ^No1 CONV / ID1~5 | 5V> | 3V3> | Servo Power / Switch | VoltageMeter | CPU Power / Switch | Battery Input State> | ^Battery Input | Power Input State> | ^Power Input (Priority)
bPlace: RoboCup Soccer Humanoid Team CIT Brains / http://www.cit-brains.net/ / / SUSTAINA MainBoard Ver2.2 / / Designed by Masato Kubotera on April 10, 2022.